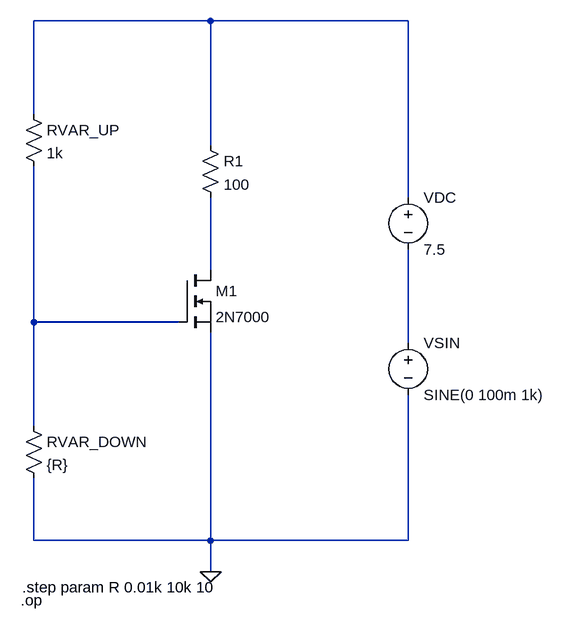
[diagram p0: schematic moschar_04_02_01_moschar.asc]
moschar_04_02_01_moschar.asc, the LTspice schematic file:
Version 4
SHEET 1 5032 1768
WIRE 3632 352 3360 352
WIRE 3936 352 3632 352
WIRE 3360 496 3360 352
WIRE 3632 544 3632 352
WIRE 3936 624 3936 352
WIRE 3632 736 3632 624
WIRE 3360 816 3360 576
WIRE 3584 816 3360 816
WIRE 3936 848 3936 704
WIRE 3360 976 3360 816
WIRE 3360 1152 3360 1056
WIRE 3632 1152 3632 832
WIRE 3632 1152 3360 1152
WIRE 3936 1152 3936 928
WIRE 3936 1152 3632 1152
WIRE 3632 1200 3632 1152
FLAG 3632 1200 0
SYMBOL nmos 3584 736 R0
SYMATTR InstName M1
SYMATTR Value 2N7000
SYMBOL res 3616 528 R0
SYMATTR InstName R1
SYMATTR Value 100
SYMBOL voltage 3936 608 R0
WINDOW 123 0 0 Left 2
WINDOW 39 0 0 Left 2
SYMATTR InstName VDC
SYMATTR Value 7.5
SYMBOL voltage 3936 832 R0
WINDOW 123 0 0 Left 2
WINDOW 39 0 0 Left 2
SYMATTR InstName VSIN
SYMATTR Value SINE(0 100m 1k)
SYMBOL res 3344 960 R0
SYMATTR InstName RVAR_DOWN
SYMATTR Value {R}
SYMBOL res 3344 480 R0
SYMATTR InstName RVAR_UP
SYMATTR Value 1k
TEXT 3342 1224 Left 2 !.step param R 0.01k 10k 10
TEXT 3340 1244 Left 2 !.op

The netlist it stands for:
* moschar_04_02_01_moschar.asc
M1 N002 N003 0 0 2N7000
R1 N001 N002 100
VDC N001 N004 7.5
VSIN N004 0 SINE(0 100m 1k)
RVAR_DOWN N003 0 {R}
RVAR_UP N001 N003 1k
.model NMOS NMOS
.model PMOS PMOS
.lib standard.mos
.step param R 0.01k 10k 10
.op
.backanno
.end